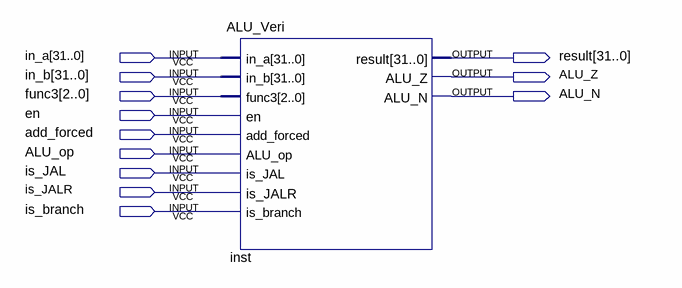
[diagram p0: schematic sheet]
// Quartus schematic testALU.bdf as structural Verilog: 1 symbols, 12 pins
module testALU (
  input  [31:0] in_a,
  input  [31:0] in_b,
  input  [2:0] func3,
  input  en,
  input  add_forced,
  input  ALU_op,
  input  is_JAL,
  input  is_JALR,
  input  is_branch,
  output [31:0] result,
  output ALU_Z,
  output ALU_N
);

  ALU_Veri inst (
    .in_a(in_a), .in_b(in_b), .func3(func3), .en(en), .add_forced(add_forced), .ALU_op(ALU_op),
    .is_JAL(is_JAL), .is_JALR(is_JALR), .is_branch(is_branch), .result(result), .ALU_Z(ALU_Z), .ALU_N(ALU_N));
endmodule
